# EAGLE design arduinoSerialProg (EAGLE 7.1.0)
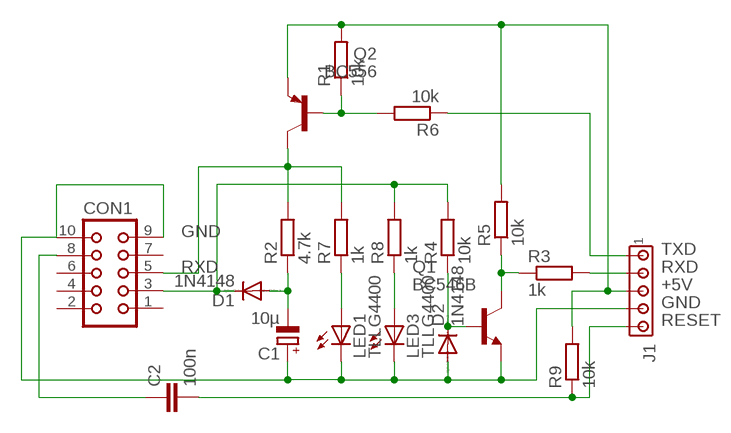
[diagram p0: schematic, sheet 1]

## Parts
C1  10µ  CPOL-EUE2,5-6E  [E2,5-6E]
C2  100n  C-EU050-025X075  [C050-025X075]
CON1  CON10  [CON10]
D1  1N4148  1N4148DO35-10  [DO35-10]
D2  1N4148  1N4148DO35-10  [DO35-10]
J1  MTA05-100  [10X05MTA]
LED1  TLLG4400  [LED3MM]
LED3  TLLG4400  [LED3MM]
Q1  BC546B  [TO92-EBC]
Q2  BC556  [TO92-EBC]
R1  10k  R-EU_0204/2V  [0204V]
R2  4.7k  R-EU_0207/10  [0207/10]
R3  1k  R-EU_0207/10  [0207/10]
R4  10k  R-EU_0207/10  [0207/10]
R5  10k  R-EU_0204/2V  [0204V]
R6  10k  R-EU_0207/10  [0207/10]
R7  1k  R-EU_0207/10  [0207/10]
R8  1k  R-EU_0207/10  [0207/10]
R9  10k  R-EU_0207/10  [0207/10]

## Nets
+5V: J1.3 Q2.E R1.2 R5.2 R9.2
DTR: C2.1 CON1.8
GND: C1.+ CON1.9 CON1.10 D2.A J1.4 LED1.K(C) LED3.K(C) Q1.E
N$3: LED1.A R7.1
N$8: C1.- D1.A R2.1
N$9: LED3.A R8.1
N$10: Q2.B R1.1 R6.2
N$11: Q1.C R3.1 R5.1
N$12: D2.C Q1.B R4.1
RESET: C2.2 J1.5 R9.1
RXD: CON1.5 J1.2 Q2.C R2.2 R3.2 R7.2
TXD: CON1.3 D1.C J1.1 R4.2 R6.1 R8.2
Unconnected: CON1.1 CON1.2 CON1.4 CON1.6 CON1.7

## Library data of the parts
C1 = rcl:CPOL-EU: POLARIZED CAPACITOR, European symbol
C2 = rcl:C-EU: CAPACITOR, European symbol
CON1 = con-harting:CON10: CONNECTOR; OC_FARNELL: unknown; OC_NEWARK: unknown
D1 D2 = diode:1N4148: DIODE high speed (Philips)
J1 = con-amp:MTA05-100: AMP connector
LED1 LED3 = led:TLLG4400: Low Current (2mA) LED 3 mm Tinted Diffused Package color GREEN Source: Data sheet <http://www.farnell.com/datasheets/391098.pdf>; MF: VISHAY SEMICONDUCTOR; OC_FARNELL: 1612435
Q1 = transistor-npn:BC546*: NPN Transistor
Q2 = transistor-pnp:BC556*: PNP Transistror
R1-R9 = rcl:R-EU_: RESISTOR, European symbol

## Board
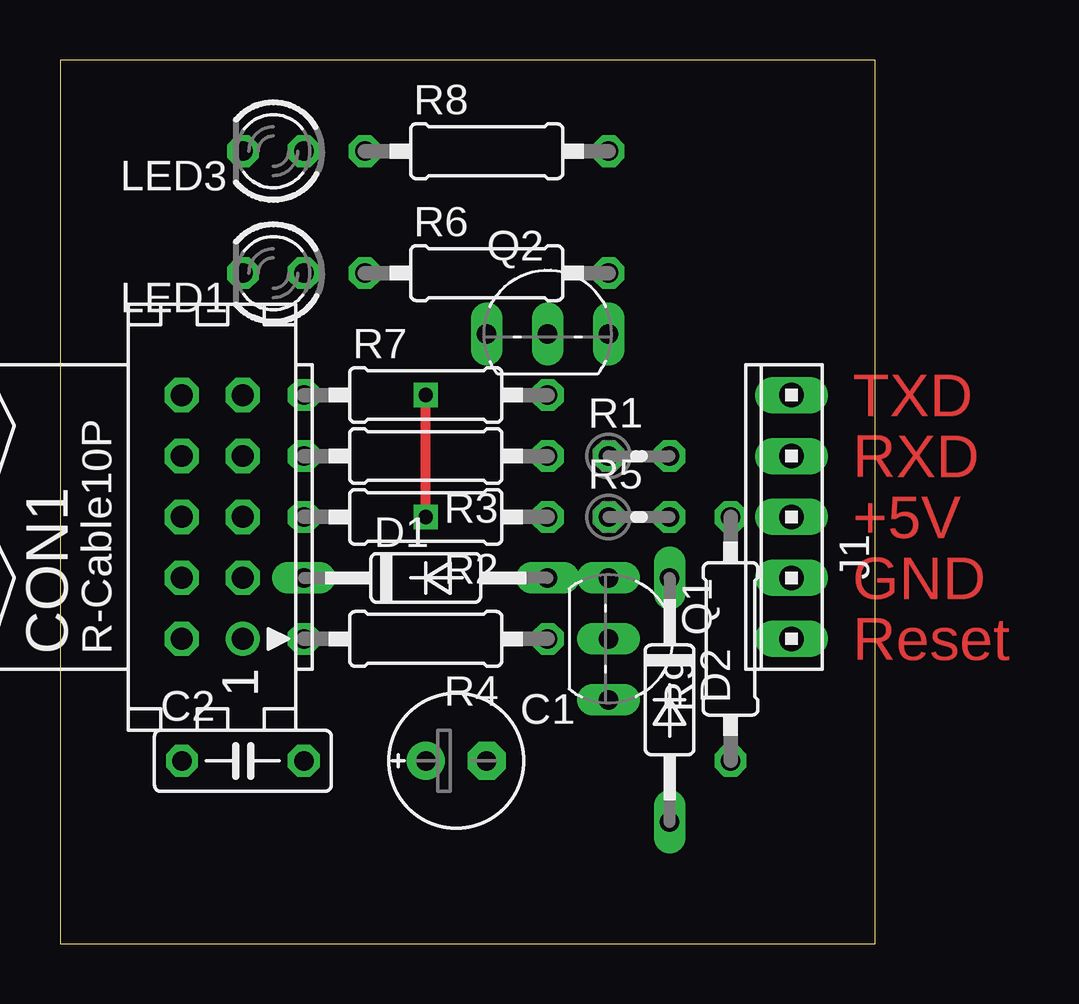
[diagram p1: board, top side]
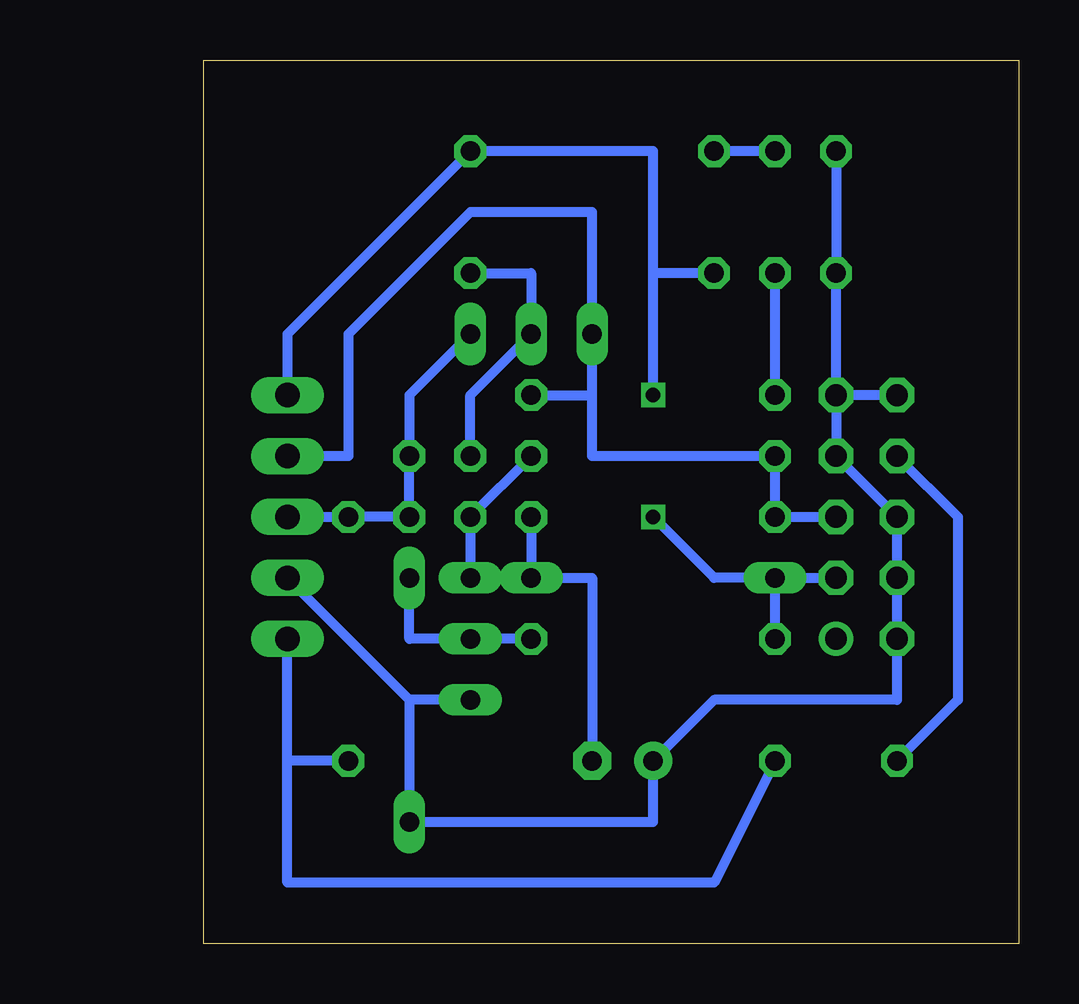
[diagram p2: board, bottom side, seen from below]

Size 33.96 x 36.82 mm. Coordinates in mm from the lower left corner, seen from the top.
Outline: 0,0 33.96,0 33.96,36.82 0,36.82 0,0
Copper layers (1*16): Top 0.035mm / dielectric 1.5mm / Bottom 0.035mm
Design rules "default": minimum track width 10mil, minimum drill 24mil, track to track 8mil, track to pad 8mil, pad to pad 8mil, via to via 8mil, smd to smd 8mil, copper to edge 40mil, drill to drill 8mil, minimum pad ring 10mil, minimum via ring 8mil, stop-mask expansion 4mil, vias tented up to drill 0mil, thermal gap 10mil

### Footprints (pad centres in the part's own frame; a part is rotated, then mirrored left to right if it is on the bottom)
E2,5-6E = drill 0.813 pad 1.575: + -1.27,0 | drill 0.813 pad 1.575 octagon: - 1.27,0
C050-025X075 = drill 0.813 octagon: 1 -2.54,0; 2 2.54,0
CON10 = drill 0.914: 1 -5.08,-1.27 | drill 0.914 octagon: 2 -5.08,1.27; 3 -2.54,-1.27; 4 -2.54,1.27; 5 0,-1.27; 6 0,1.27; 7 2.54,-1.27; 8 2.54,1.27; 9 5.08,-1.27; 10 5.08,1.27
DO35-10 = drill 0.813 long: A 5.08,0; C -5.08,0
10X05MTA = drill 1.016 long: 1 5.08,0; 2 2.54,0; 3 0,0; 4 -2.54,0; 5 -5.08,0
LED3MM = drill 0.813 octagon: A -1.27,0; K 1.27,0
TO92-EBC = drill 0.813 long: B 0,-1.27; C -2.54,-1.27; E 2.54,-1.27
0204V = drill 0.813 octagon: 1 -1.27,0; 2 1.27,0
0207/10 = drill 0.813 octagon: 1 -5.08,0; 2 5.08,0

### Placement (x,y rotation side)
C1  16.51,7.62 0 top
C2  7.62,7.62 0 top
CON1  6.35,17.78 90 top
D1  15.24,15.24 0 top
D2  25.4,10.16 270 top
J1  30.48,17.78 90 top
LED1  8.89,27.94 180 top
LED3  8.89,33.02 180 top
Q1  24.13,12.7 270 top
Q2  20.32,26.67 0 top
R1  24.13,20.32 0 top
R2  15.24,17.78 180 top
R3  15.24,20.32 180 top
R4  15.24,12.7 180 top
R5  24.13,17.78 0 top
R6  17.78,27.94 0 top
R7  15.24,22.86 0 top
R8  17.78,33.02 0 top
R9  27.94,12.7 90 top

### Tracks (layer width: path | path; a pad name or v marks a point on that pad's centre or on a via)
+5V
  Bottom 0.406: Q2.E 25.4,22.86 R1.2 R5.2 R9.2 J1.3
DTR
  Bottom 0.406: CON1.8 2.54,17.78 2.54,10.16 C2.1
GND
  Bottom 0.406: LED3.K LED1.K CON1.9 | CON1.10 CON1.9 | CON1.9 7.62,20.32 5.08,17.78 5.08,10.16 12.7,10.16 C1.+ 15.24,5.08 D2.A 25.4,10.16 | Q1.E 25.4,10.16 | 25.4,10.16 J1.4
N$3
  Bottom 0.406: R7.1 LED1.A
N$8
  Bottom 0.406: R2.1 D1.A 17.78,15.24 C1.-
N$9
  Bottom 0.406: LED3.A R8.1
N$10
  Bottom 0.406: R6.2 20.32,27.94 Q2.B 22.86,22.86 R1.1
N$11
  Bottom 0.406: R3.1 R5.1 Q1.C
N$12
  Bottom 0.406: R4.1 Q1.B 25.4,12.7 D2.C
RESET
  Bottom 0.406: C2.2 12.7,2.54 30.48,2.54 30.48,7.62 | 30.48,7.62 J1.5 | R9.1 30.48,7.62
RXD
  Bottom 0.406: CON1.5 R2.2 R3.2 17.78,20.32 17.78,22.86 | J1.2 27.94,20.32 27.94,25.4 22.86,30.48 17.78,30.48 Q2.C 17.78,22.86 | R7.2 17.78,22.86
TXD  (via drill 0.6)
  Top 0.406: v15.24,17.78 v15.24,22.86
  Bottom 0.406: R6.1 15.24,27.94 | R4.2 D1.C | D1.C CON1.3 | D1.C 12.7,15.24 v15.24,17.78 | v15.24,22.86 15.24,27.94 | 15.24,27.94 15.24,33.02 R8.2 30.48,25.4 J1.1

### Text on the board
Top: TXD | RXD | +5V | GND | Reset